# EAGLE design EW07 (EAGLE 4.16)
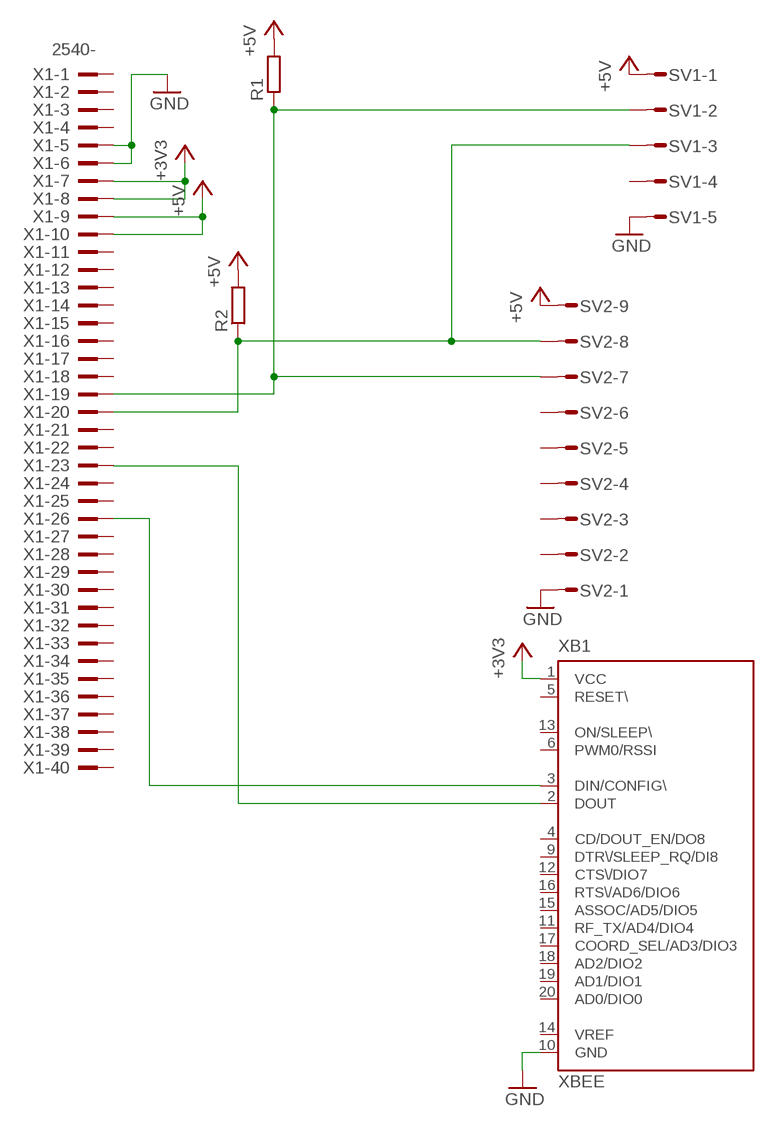
[diagram p0: schematic, sheet 1]

## Parts
R1  R-EU_0204/7  [0204/7]
R2  R-EU_0204/7  [0204/7]
SV1  S05P  [S05P]
SV2  S09P  [S09P]
X1  2540-  [PAK100/2500-40]
XB1  XBEE  [XBEE]

## Nets
+3V3: X1.7 X1.8 XB1.1(VCC)
+5V: R1.2 R2.2 SV1.1 SV2.9 X1.9 X1.10
GND: SV1.5 SV2.1 X1.5 X1.6 XB1.10(GND)
N$1: X1.23 XB1.2(DOUT)
N$2: X1.26 XB1.3(DIN/CONFIG\)
N$6: R1.1 SV1.2 SV2.7 X1.19
N$7: R2.1 SV1.3 SV2.8 X1.20
Unconnected: SV1.4 SV2.2 SV2.3 SV2.4 SV2.5 SV2.6 X1.1 X1.2 X1.3 X1.4 X1.11 X1.12 X1.13 X1.14 X1.15 X1.16 X1.17 X1.18 X1.21 X1.22 X1.24 X1.25 X1.27 X1.28 X1.29 X1.30 X1.31 X1.32 X1.33 X1.34 X1.35 X1.36 X1.37 X1.38 X1.39 X1.40 XB1.4(CD/DOUT_EN/DO8) XB1.5(RESET\) XB1.6(PWM0/RSSI) XB1.9(DTR\/SLEEP_RQ/DI8) XB1.11(RF_TX/AD4/DIO4) XB1.12(CTS\/DIO7) XB1.13(ON/SLEEP\) XB1.14(VREF) XB1.15(ASSOC/AD5/DIO5) XB1.16(RTS\/AD6/DIO6) XB1.17(COORD_SEL/AD3/DIO3) XB1.18(AD2/DIO2) XB1.19(AD1/DIO1) XB1.20(AD0/DIO0)

## Library data of the parts
R1 R2 = rcl:R-EU_: RESISTOR, European symbol
SV1 = con-amp-mt:S05P: AMP MT CONNECTOR
SV2 = con-amp-mt:S09P: AMP MT CONNECTOR
X1 = con-3m:2540-: 3M (TM) Pak 100 4-Wall Header Source: 3M
XB1 = maxstream:XBEE: XBee (TM) /XBee-PRO(TM) OEM RF Modules Source: MaxStream, Inc. xbee_productmanual.pdf

## Board
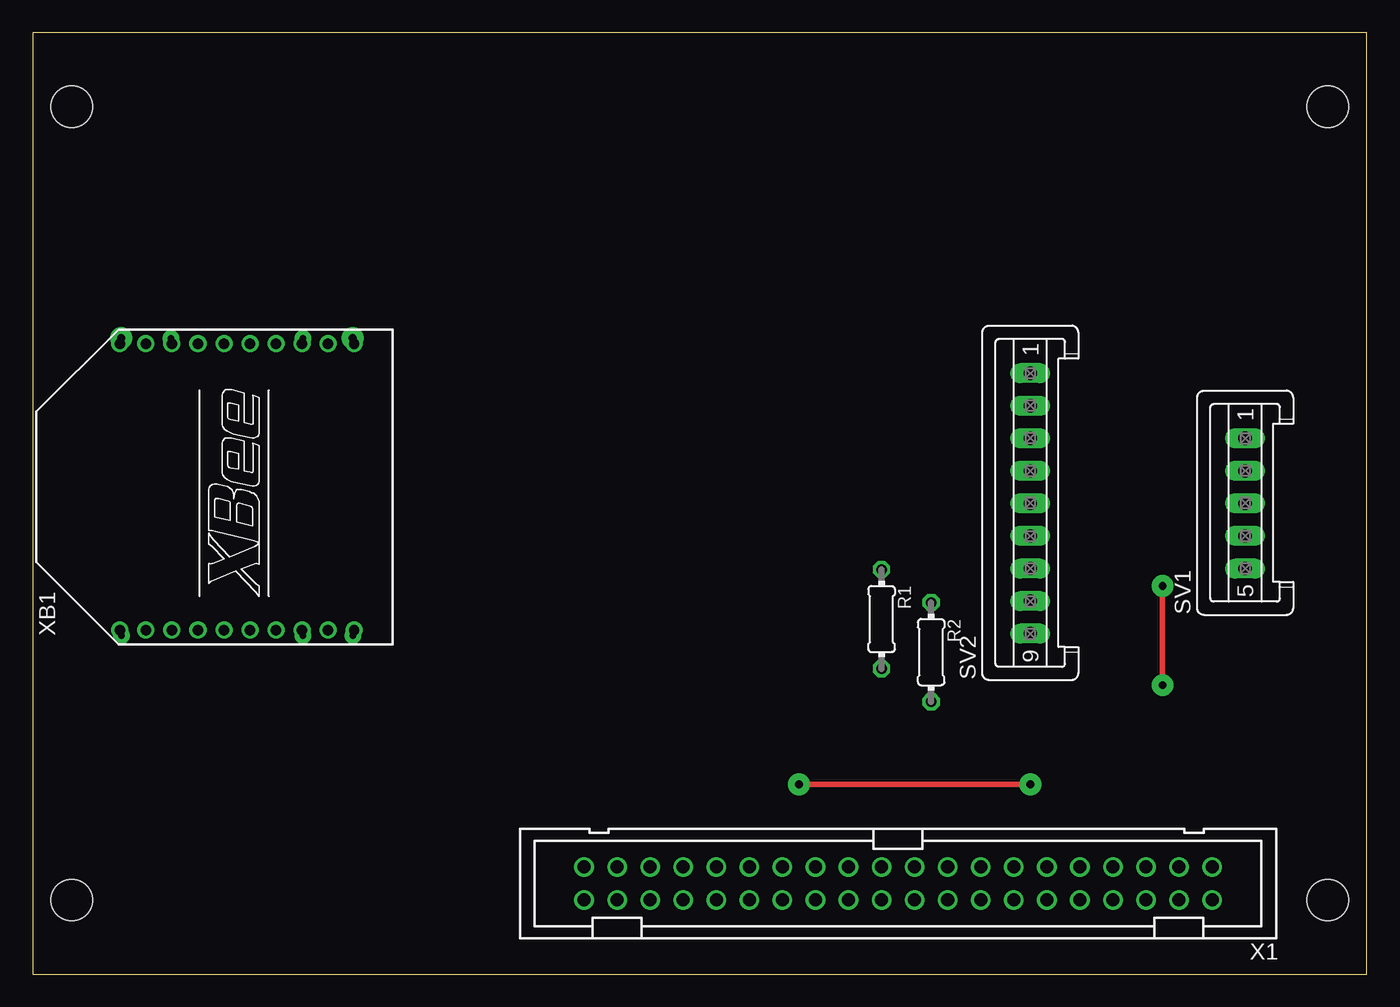
[diagram p1: board, top side]
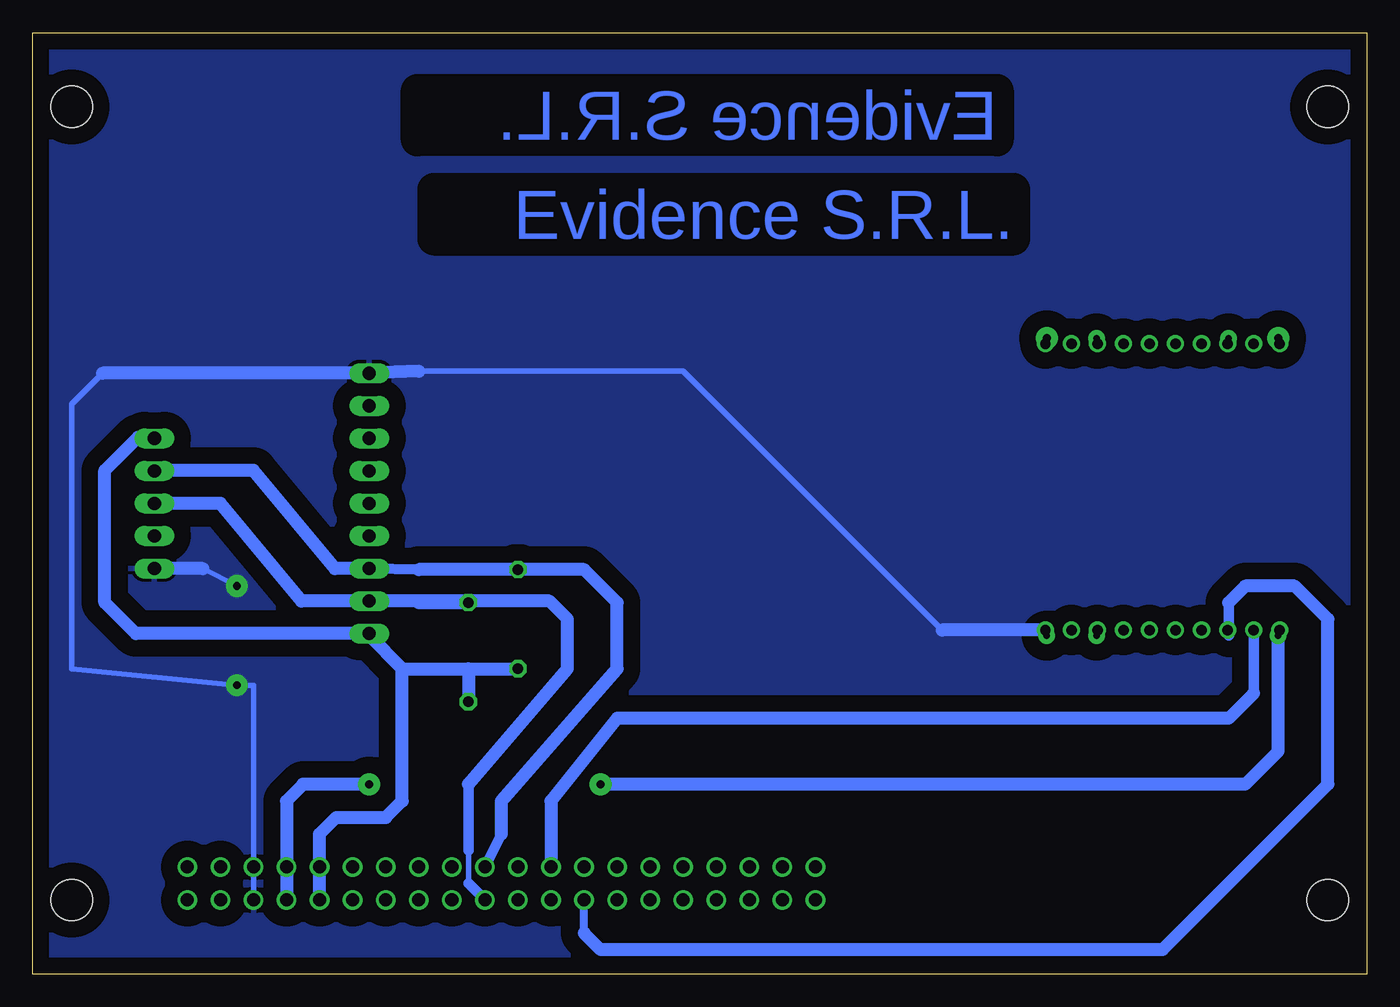
[diagram p2: board, bottom side, seen from below]

Size 102.54 x 72.38 mm. Coordinates in mm from the lower left corner, seen from the top.
Outline: 0,0 102.54,0 102.54,72.38 0,72.38 0,0
Copper layers (1*16): Top 0.035mm / dielectric 1.5mm / Bottom 0.035mm
Design rules "default": minimum track width 10mil, minimum drill 24mil, track to track 8mil, track to pad 8mil, pad to pad 8mil, via to via 8mil, smd to smd 8mil, copper to edge 40mil, drill to drill 8mil, minimum pad ring 10mil, minimum via ring 8mil, stop-mask expansion 4mil, vias tented up to drill 0mil, thermal gap 10mil
Holes 3.2 mm at 3.01,5.71 3.01,66.67 99.53,66.67 99.53,5.71

### Footprints (pad centres in the part's own frame; a part is rotated, then mirrored left to right if it is on the bottom)
0204/7 = drill 0.813 octagon: 1 -3.81,0; 2 3.81,0
S05P = drill 1.016 long: 1 5,0; 2 2.5,0; 3 0,0; 4 -2.5,0; 5 -5,0
S09P = drill 1.016 long: 1 10,0; 2 7.5,0; 3 5,0; 4 2.5,0; 5 0,0; 6 -2.5,0; 7 -5,0; 8 -7.5,0; 9 -10,0
PAK100/2500-40 = drill 1 pad 1.422 round: 1 -24.13,-1.27; 2 -24.13,1.27; 3 -21.59,-1.27; 4 -21.59,1.27; 5 -19.05,-1.27; 6 -19.05,1.27; 7 -16.51,-1.27; 8 -16.51,1.27; 9 -13.97,-1.27; 10 -13.97,1.27; 11 -11.43,-1.27; 12 -11.43,1.27; 13 -8.89,-1.27; 14 -8.89,1.27; 15 -6.35,-1.27; 16 -6.35,1.27; 17 -3.81,-1.27; 18 -3.81,1.27; 19 -1.27,-1.27; 20 -1.27,1.27; 21 1.27,-1.27; 22 1.27,1.27; 23 3.81,-1.27; 24 3.81,1.27; 25 6.35,-1.27; 26 6.35,1.27; 27 8.89,-1.27; 28 8.89,1.27; 29 11.43,-1.27; 30 11.43,1.27; 31 13.97,-1.27; 32 13.97,1.27; 33 16.51,-1.27; 34 16.51,1.27; 35 19.05,-1.27; 36 19.05,1.27; 37 21.59,-1.27; 38 21.59,1.27; 39 24.13,-1.27; 40 24.13,1.27
XBEE = drill 0.8 pad 1.27 round: 1 -11,9; 2 -11,7; 3 -11,5; 4 -11,3; 5 -11,1; 6 -11,-1; 7 -11,-3; 8 -11,-5; 9 -11,-7; 10 -11,-9; 11 11,-9; 12 11,-7; 13 11,-5; 14 11,-3; 15 11,-1; 16 11,1; 17 11,3; 18 11,5; 19 11,7; 20 11,9

### Placement (x,y rotation side)
R1  65.24,27.3 270 top
R2  69.05,24.76 270 top
SV1  93.18,36.19 90 top
SV2  76.67,36.19 90 top
X1  66.51,6.98 180 top
XB1  15.71,37.46 90 top

### Tracks (layer width: path | path; a pad name or v marks a point on that pad's centre or on a via)
+3V3  (via drill 0.5 pad 1.27, 0.6 pad 1.68)
  Top 0.406: v58.89,14.6 v76.67,14.6
  Bottom 0.406: v6.82,26.03 6.71,26.14 XB1.1
  Bottom 1.016: X1.8 X1.7 83.02,13.33 81.75,14.6 v76.67,14.6 | v58.89,14.6 9.36,14.6 6.82,17.14 v6.82,26.03
+5V
  Bottom 0.406: 76.67,26.03 SV2.9 | 94.45,41.27 SV1.1
  Bottom 1.016: 69.05,23.49 R1.2 | 74.13,23.49 69.05,23.49 | 74.13,23.49 76.67,26.03 | 69.05,23.49 R2.2 | X1.10 X1.9 80.48,10.79 79.21,12.06 75.4,12.06 74.13,13.33 74.13,23.49 | SV2.9 94.61,26.19 96.99,28.57 96.99,38.73 94.45,41.27
GND  (via drill 0.6 pad 1.68)
  Top 0.406: v86.83,22.22 v86.83,29.84
  Bottom 0.406: 32.65,26.46 52.54,46.35 72.86,46.35 | 97.15,46.19 99.53,43.81 99.53,23.49 v86.83,22.22 85.56,22.22 X1.5 X1.6 | v86.83,29.84 89.45,31.19
  Bottom 1.016: XB1.10 32.65,26.46 | 72.86,46.35 SV2.1 97.15,46.19 | 89.45,31.19 SV1.5
  pour Bottom (isolate 1.27): 0.47,71.75 102.07,71.75 102.07,0.63 0.47,0.63
N$1
  Bottom 0.813: 8.71,21.6 XB1.2
  Bottom 1.016: X1.23 62.7,13.33 57.62,19.68 10.63,19.68 8.71,21.6
N$2
  Bottom 0.406: 10.63,26.03 10.71,26.11 XB1.3
  Bottom 0.61: 60.16,3.17 X1.26
  Bottom 0.813: 10.63,28.57 10.63,26.03
  Bottom 1.016: 60.16,3.17 58.89,1.9 15.71,1.9 3.01,14.6 3.01,27.3 5.55,29.84 9.36,29.84 10.63,28.57
N$3  (via drill 0.6 pad 1.68)
  other vias: 24.6,48.89
N$4  (via drill 0.6 pad 1.68)
  other vias: 6.82,48.89
N$5  (via drill 0.5 pad 1.27)
  other vias: 24.6,26.03
N$6
  Bottom 0.406: 93.18,38.73 SV1.2
  Bottom 0.813: 72.86,31.11 SV2.7 | X1.19 66.51,10.79
  Bottom 1.016: SV2.7 79.29,31.19 85.56,38.73 93.18,38.73 | 72.86,31.11 R1.1 60.16,31.11 57.62,28.57 57.62,23.49 66.51,13.33 66.51,10.79
N$7
  Bottom 0.406: SV2.8 72.86,28.57 | 69.05,6.98 69.05,9.52
  Bottom 0.813: 69.05,9.52 69.05,14.6 | X1.20 69.05,6.98
  Bottom 1.016: 72.86,28.57 R2.1 | 69.05,14.6 61.43,23.49 61.43,27.3 62.82,28.69 SV2.8 81.87,28.69 88.1,36.19 SV1.3
N$8  (via drill 0.5 pad 1.27)
  other vias: 20.79,26.03
N$9  (via drill 0.5 pad 1.27)
  other vias: 20.79,48.89
N$10  (via drill 0.5 pad 1.27)
  other vias: 10.63,48.89

### Text on the board
Bottom: Evidence S.R.L. | Evidence S.R.L.